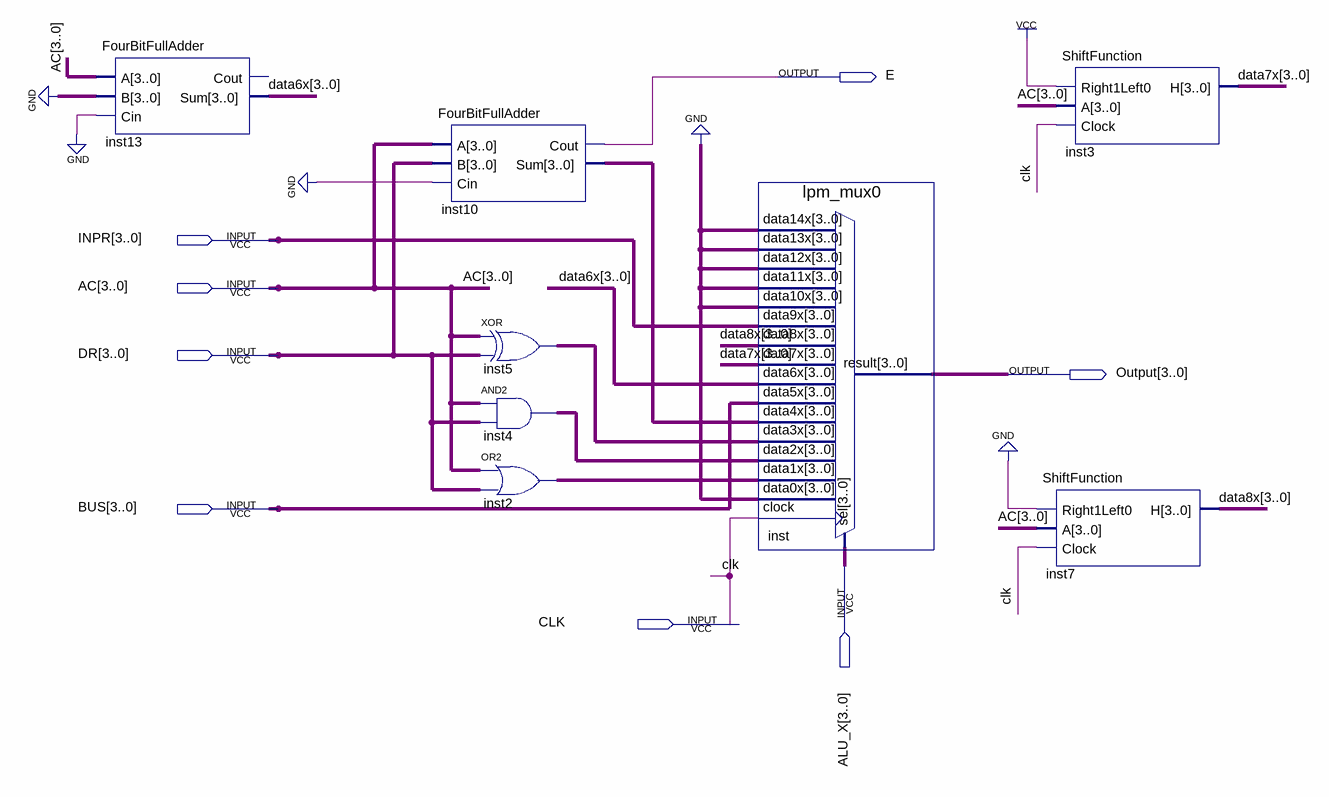
[diagram p0: schematic sheet]
// Quartus schematic ArithmaticLogicUnit.bdf as structural Verilog: 8 symbols, 8 pins
module ArithmaticLogicUnit (
  input  [3:0] INPR,
  input  [3:0] AC,
  input  [3:0] DR,
  input  [3:0] BUS,
  input  [3:0] ALU_X,
  input  CLK,
  output E,
  output [3:0] Output
);

  wire [3:0] data6x, data7x, data8x, inst2_out, inst4_out, inst5_out, inst10_sum;

  FourBitFullAdder inst13 (.A(AC), .B(4'b0000), .Cin(1'b0), .Sum(data6x));  // open: Cout
  FourBitFullAdder inst10 (.A(AC), .B(DR), .Cin(1'b0), .Cout(E), .Sum(inst10_sum));
  assign inst5_out = AC ^ DR;  // XOR inst5, 4 bits wide
  assign inst4_out = AC & DR;  // AND2 inst4, 4 bits wide
  assign inst2_out = AC | DR;  // OR2 inst2, 4 bits wide
  lpm_mux0 inst (
    .data14x(4'b0000), .data13x(4'b0000), .data12x(4'b0000), .data11x(4'b0000), .data10x(4'b0000),
    .data9x(INPR), .data8x(data8x), .data7x(data7x), .data6x(data6x), .data5x(BUS), .data4x(inst10_sum),
    .data3x(inst5_out), .data2x(inst4_out), .data1x(inst2_out), .data0x(4'b0000), .clock(CLK), .sel(ALU_X),
    .result(Output));
  ShiftFunction inst7 (.Right1Left0(1'b0), .A(AC), .Clock(CLK), .H(data8x));
  ShiftFunction inst3 (.Right1Left0(1'b1), .A(AC), .Clock(CLK), .H(data7x));
endmodule
